# EAGLE design water-pump (EAGLE 9.2.2)
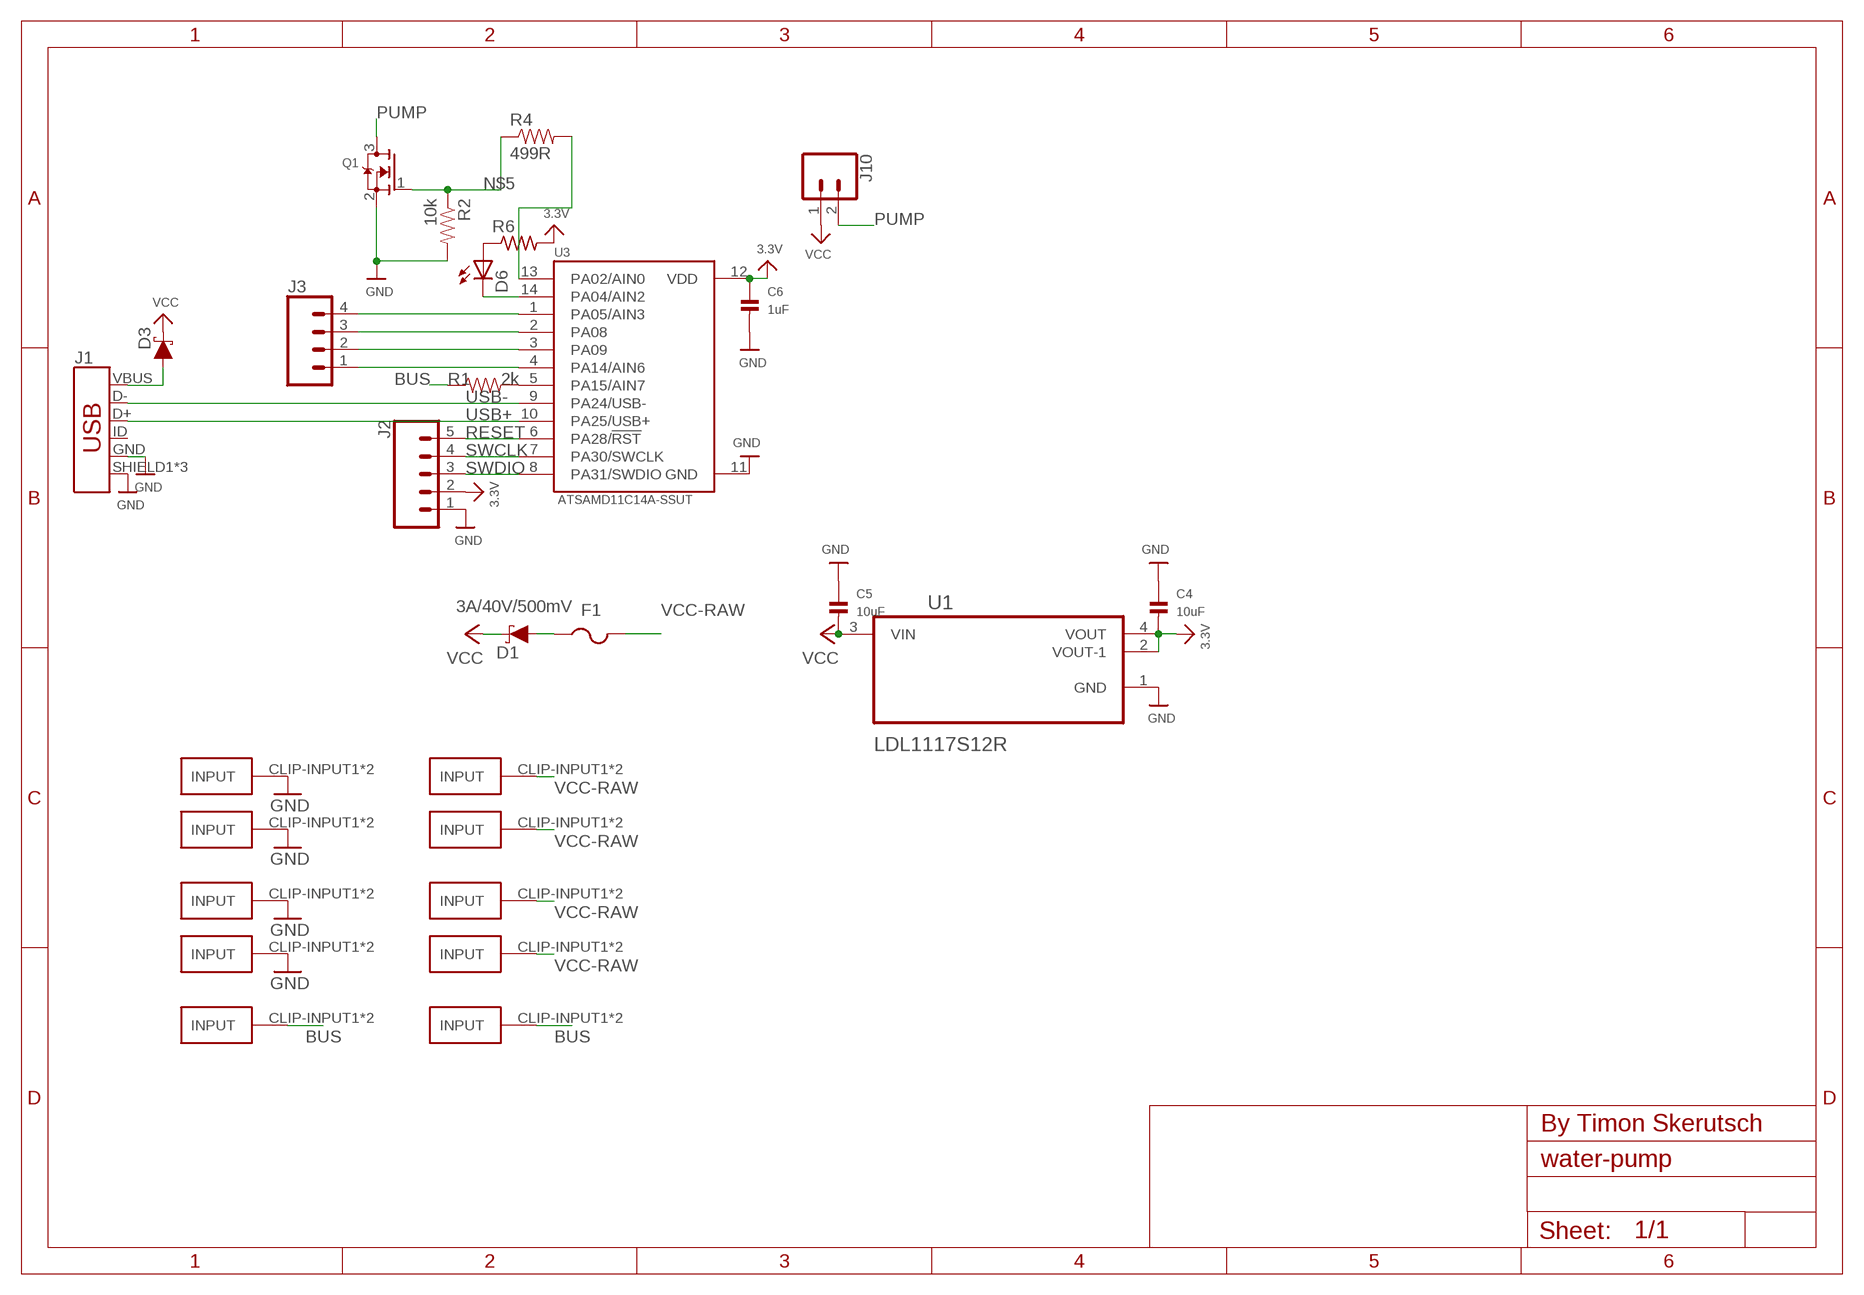
[diagram p0: schematic, sheet 1]

## Parts
C4  10uF  CAP_CERAMIC0805  [0805]
C5  10uF  CAP_CERAMIC0805  [0805]
C6  1uF  CAP_CERAMIC0603  [0603]
D1  3A/40V/500mV  DIODE-SCHOTTKY-B340A  [SMA-DIODE]
D3  3A/40V/500mV  DIODE-SCHOTTKY-B340A  [SMA-DIODE]
D6  LEDCHIPLED_0805  [CHIPLED_0805]
F1  PTCFUSE-1812  [1812]
GND-CLIP  FUSE-HOLDER-5X20MM  [FUSE-HOLDER-5X20MM]
GND-CLIP1  FUSE-HOLDER-5X20MM  [FUSE-HOLDER-5X20MM]
GND-CLIP2  FUSE-HOLDER-5X20MM  [FUSE-HOLDER-5X20MM]
GND-CLIP3  FUSE-HOLDER-5X20MM  [FUSE-HOLDER-5X20MM]
J1  USB_MICRO-B_FEMALE-SMT  [USB-B-MICRO-SMD]
J2  CONN_05  [1X05]
J3  CONN_04PTH  [1X04]
J10  CONN_02PTH3  [1X02_LONGPADS]
PWM-CLIP  FUSE-HOLDER-5X20MM  [FUSE-HOLDER-5X20MM]
PWM-CLIP1  FUSE-HOLDER-5X20MM  [FUSE-HOLDER-5X20MM]
Q1  MOSFET-NWIDE  [SOT23-WIDE]
R1  2k  RESISTOR1206  [1206]
R2  10k  RESISTOR1206  [1206]
R4  499R  RESISTOR1206  [1206]
R6  R-US_R0805  [R0805]
U1  LDL1117S12R  [SOT230P700X180-4N]
U3  ATSAMD11C14A-SSUT  [SOIC127P600X160-14N]
VCC-CLIP  FUSE-HOLDER-5X20MM  [FUSE-HOLDER-5X20MM]
VCC-CLIP1  FUSE-HOLDER-5X20MM  [FUSE-HOLDER-5X20MM]
VCC-CLIP2  FUSE-HOLDER-5X20MM  [FUSE-HOLDER-5X20MM]
VCC-CLIP3  FUSE-HOLDER-5X20MM  [FUSE-HOLDER-5X20MM]

## Nets
3.3V [VCC]: C4.2 C6.1 J2.2 R6.2 U1.2(VOUT-1) U1.4(VOUT) U3.12(VDD)
BUS: PWM-CLIP1.CLIP-INPUT1(INPUT) PWM-CLIP1.CLIP-INPUT2(INPUT) PWM-CLIP.CLIP-INPUT1(INPUT) PWM-CLIP.CLIP-INPUT2(INPUT) R1.1
GND: C4.1 C5.1 C6.2 GND-CLIP1.CLIP-INPUT1(INPUT) GND-CLIP1.CLIP-INPUT2(INPUT) GND-CLIP2.CLIP-INPUT1(INPUT) GND-CLIP2.CLIP-INPUT2(INPUT) GND-CLIP3.CLIP-INPUT1(INPUT) GND-CLIP3.CLIP-INPUT2(INPUT) GND-CLIP.CLIP-INPUT1(INPUT) GND-CLIP.CLIP-INPUT2(INPUT) J1.GND J1.SHIELD1(SHIELD) J1.SHIELD2(SHIELD) J1.SHIELD3(SHIELD) J2.1 Q1.2(S) R2.2 U1.1(GND) U3.11(GND)
N$1: D3.A J1.VBUS
N$3: R1.2 U3.5(PA15/AIN7)
N$4: J3.4 U3.1(PA05/AIN3)
N$5: Q1.1(G) R2.1 R4.1
N$6 [VCC]: D1.A F1.1
N$7: D6.A R6.1
N$8: D6.C U3.14(PA04/AIN2)
N$9: J3.3 U3.2(PA08)
N$10: J3.2 U3.3(PA09)
N$11: J3.1 U3.4(PA14/AIN6)
PUMP: J10.2 Q1.3(D)
PUMP_CTRL: R4.2 U3.13(PA02/AIN0)
RESET: J2.5 U3.6(PA28/!RST)
SWCLK: J2.4 U3.7(PA30/SWCLK)
SWDIO: J2.3 U3.8(PA31/SWDIO)
USB+: J1.D+ U3.10(PA25/USB+)
USB-: J1.D- U3.9(PA24/USB-)
VCC [VCC]: C5.2 D1.C D3.C J10.1 U1.3(VIN)
VCC-RAW [VCC]: F1.2 VCC-CLIP1.CLIP-INPUT1(INPUT) VCC-CLIP1.CLIP-INPUT2(INPUT) VCC-CLIP2.CLIP-INPUT1(INPUT) VCC-CLIP2.CLIP-INPUT2(INPUT) VCC-CLIP3.CLIP-INPUT1(INPUT) VCC-CLIP3.CLIP-INPUT2(INPUT) VCC-CLIP.CLIP-INPUT1(INPUT) VCC-CLIP.CLIP-INPUT2(INPUT)
Unconnected: J1.ID

## Notes on the sheet
- By Timon Skerutsch

## Library data of the parts
C4-C6 = microbuilder:CAP_CERAMIC: Ceramic Capacitors 0402 - 0402 Surface Mount Capacitors 16pF 50V 5% [Digikey: 445-4899-2-ND] 18pF 50V 5% [Digikey: 490-1281-2-ND] 22pF 50V 5% [Digikey: 490-1283-2-ND] 68pF 50V 5% [Digikey: 490-1289-2-ND] 0.1uF 10V 10% [Digikey: 490-1318-2-ND] 1.0uF 6.3V 10% [Digikey: 490-1320-2-ND] 0603 - 0603 Surface Mount Capacitors 16 pF 50V 5% [Digikey: 445-5051-2-ND] 22 pF 50V [Digikey: PCC220ACVTR-ND] 33 pF 50V 5% [Digikey: 490-1415-1-ND] 56pF 50V 5% [Digikey: 490-1421-1-ND] 220pF 50V 5% [Digikey: 445-1285-1-ND] 680 pF 50V 2200 pF 50V 5% C0G [Digikey: 445-1297-1-ND] 5600 pF 100V 5% X7R [Digikey: 478-3711-1-ND] 0.1 µF 25V 10% [Digikey: PCC2277TR-ND] 0.22 µF 16V 10% X7R [Digikey: 445-1318-1-ND] 1.0 µF 25V 10% [Digikey: 445-5146-2-ND] 0603 - RF Specific 3pF 250V +/-0.1pF RF [Digikey: 712-1347-1-ND] 18 pF 250V 5% [Digikey: 478-3505-1-ND or 712-1322-1-ND] 56 pF 250V 5% C0G RF [Digikey: 490-4867-1-ND] 68 pF 250V RF [Digikey: 490-4868-1-ND] 0805 - 0805 Surface Mount Capacitors 220 pF 250V 2% RF Ceramic Capacitor [Digikey: 712-1398-1-ND] 1000 pF 50V 2% NP0 Ceramic Capacitor [Digikey: 478-3760-1-ND] 0.1 µF 25V 10% Ceramic Capacitor [Digikey: PCC1828TR-ND] 1.0 µF 16V 10% Ceramic Capacitor[Digikey: 490-1691-2-ND] 10.0 µF 10V 10% Ceramic Capacitor[Digikey: 709-1228-1-ND] 10.0 uF 16V 10% Ceramic Capacitor [Digikey: 478-5165-2-ND] 47 uF 6.3V 20% Ceramic Capacitor [Digikey: 587-1779-1-ND or 399-5506-1-ND] 1206 - 1206 Surface Mount Capacitors 47uF 10V 20% Ceramic Capacitor [Digikey: 490-5528-1-ND or 399-5508-1-ND or 445-6010-1-ND] 100uF 6.3V -20%, +80% Y5V Ceramic Capacitor (Digikey: 490-4512-1-ND, Mouser: 81-GRM31CF50J107ZE1L)
D1 D3 = SparkFun-DiscreteSemi:DIODE-SCHOTTKY: Schottky diode A Schottky diode is a semiconductor diode which has a low forward voltage drop and a very fast switching action.; PROD_ID: DIO-09886
D6 = Adafruit:LED: LED OSRAM: - CHIPLED LG R971, LG N971, LY N971, LG Q971, LY Q971, LO R971, LY R971 LH N974, LH R974 LS Q976, LO Q976, LY Q976 LO Q996 - Hyper CHIPLED LW Q18S LB Q993, LB Q99A, LB R99A - SideLED LS A670, LO A670, LY A670, LG A670, LP A670 LB A673, LV A673, LT A673, LW A673 LH A674 LY A675 LS A676, LA A676, LO A676, LY A676, LW A676 LS A679, LY A679, LG A679 - Hyper Micro SIDELED® LS Y876, LA Y876, LO Y876, LY Y876 LT Y87S - SmartLED LW L88C, LW L88S LB L89C, LB L89S, LG L890 LS L89K, LO L89K, LY L89K LS L896, LA L896, LO L896, LY L896 - TOPLED LS T670, LO T670, LY T670, LG T670, LP T670 LSG T670, LSP T670, LSY T670, LOP T670, LYG T670 LG T671, LOG T671, LSG T671 LB T673, LV T673, LT T673, LW T673 LH T674 LS T676, LA T676, LO T676, LY T676, LB T676, LH T676, LSB T676, LW T676 LB T67C, LV T67C, LT T67C, LS T67K, LO T67K, LY T67K, LW E67C LS E67B, LA E67B, LO E67B, LY E67B, LB E67C, LV E67C, LT E67C LW T67C LS T679, LY T679, LG T679 LS T770, LO T770, LY T770, LG T770, LP T770 LB T773, LV T773, LT T773, LW T773 LH T774 LS E675, LA E675, LY E675, LS T675 LS T776, LA T776, LO T776, LY T776, LB T776 LHGB T686 LT T68C, LB T68C - Hyper Mini TOPLED® LB M676 - Mini TOPLED Santana® LG M470 LS M47K, LO M47K, LY M47K Source: http://www.osram.convergy.de/
F1 = Adafruit:PTCFUSE: PTC fuses, resettable thermistors
GND-CLIP GND-CLIP1-GND-CLIP3 PWM-CLIP PWM-CLIP1 VCC-CLIP VCC-CLIP1-VCC-CLIP3 = timon-diverses:FUSE-HOLDER-5X20MM
J1 = SparkFun-Connectors:USB_MICRO-B: USB Type Micro-B Connector Male/female and PTH/SMT variants SparkFun Products: SparkFun microB USB Breakout <https://www.sparkfun.com/products/12035> SparkFun USB microB Plug Breakout <https://www.sparkfun.com/products/10031> SparkFun ESP8266 Thing <https://www.sparkfun.com/products/13231>; PROD_ID: CONN-11752
J2 = SparkFun-Connectors:CONN_05: Multi connection point. Often used as Generic Header-pin footprint for 0.1 inch spaced/style header connections On any of the 0.1 inch spaced packages, you can populate with these: Break Away Headers - Straight <https://www.sparkfun.com/products/116> (PRT-00116) Break Away Male Headers - Right Angle <https://www.sparkfun.com/products/553> (PRT-00553) Female Headers <https://www.sparkfun.com/products/115> (PRT-00115) Break Away Headers - Machine Pin <https://www.sparkfun.com/products/117> (PRT-00117) Break Away Female Headers - Swiss Machine Pin <https://www.sparkfun.com/products/743> (PRT-00743) For SCREWTERMINALS and SPRING TERMINALS visit here: Screw Terimnals on SparkFun.com <https://www.sparkfun.com/search/results?term=Screw+Terminals> (5mm/3.5mm/2.54mm spacing) This device is also useful as a general connection point to wire up your design to another part of your project. Our various solder wires solder well into these plated through hole pads. Hook-Up Wire - Assortment (Stranded, 22 AWG) <https://www.sparkfun.com/products/11375> (PRT-11375) Hook-Up Wire - Assortment (Solid Core, 22 AWG) <https://www.sparkfun.com/products/11367> (PRT-11367) View the entire wire category on our website here <https://www.sparkfun.com/categories/141> Special notes: Molex polarized connector foot print use with SKU : PRT-08231 with associated crimp pins and housings. 1MM SMD Version SKU: PRT-10208
J3 = SparkFun-Connectors:CONN_04: Multi connection point. Often used as Generic Header-pin footprint for 0.1 inch spaced/style header connections On any of the 0.1 inch spaced packages, you can populate with these: Break Away Headers - Straight <https://www.sparkfun.com/products/116> (PRT-00116) Break Away Male Headers - Right Angle <https://www.sparkfun.com/products/553> (PRT-00553) Female Headers <https://www.sparkfun.com/products/115> (PRT-00115) Break Away Headers - Machine Pin <https://www.sparkfun.com/products/117> (PRT-00117) Break Away Female Headers - Swiss Machine Pin <https://www.sparkfun.com/products/743> (PRT-00743) For SCREWTERMINALS and SPRING TERMINALS visit here: Screw Terimnals on SparkFun.com <https://www.sparkfun.com/search/results?term=Screw+Terminals> (5mm/3.5mm/2.54mm spacing) This device is also useful as a general connection point to wire up your design to another part of your project. Our various solder wires solder well into these plated through hole pads. Hook-Up Wire - Assortment (Stranded, 22 AWG) <https://www.sparkfun.com/products/11375> (PRT-11375) Hook-Up Wire - Assortment (Solid Core, 22 AWG) <https://www.sparkfun.com/products/11367> (PRT-11367) View the entire wire category on our website here <https://www.sparkfun.com/categories/141> Special notes: Molex polarized connector foot print use with SKU : PRT-08231 with associated crimp pins and housings. 1MM SMD Version SKU: PRT-10208; PROD_ID: CONN-09696
J10 = SparkFun-Connectors:CONN_02: Multi connection point. Often used as Generic Header-pin footprint for 0.1 inch spaced/style header connections On any of the 0.1 inch spaced packages, you can populate with these: Break Away Headers - Straight <https://www.sparkfun.com/products/116> (PRT-00116) Break Away Male Headers - Right Angle <https://www.sparkfun.com/products/553> (PRT-00553) Female Headers <https://www.sparkfun.com/products/115> (PRT-00115) Break Away Headers - Machine Pin <https://www.sparkfun.com/products/117> (PRT-00117) Break Away Female Headers - Swiss Machine Pin <https://www.sparkfun.com/products/743> (PRT-00743) For SCREWTERMINALS and SPRING TERMINALS visit here: Screw Terimnals on SparkFun.com <https://www.sparkfun.com/search/results?term=Screw+Terminals> (5mm/3.5mm/2.54mm spacing) This device is also useful as a general connection point to wire up your design to another part of your project. Our various solder wires solder well into these plated through hole pads. Hook-Up Wire - Assortment (Stranded, 22 AWG) <https://www.sparkfun.com/products/11375> (PRT-11375) Hook-Up Wire - Assortment (Solid Core, 22 AWG) <https://www.sparkfun.com/products/11367> (PRT-11367) View the entire wire category on our website here <https://www.sparkfun.com/categories/141> Special notes: Molex polarized connector foot print use with: PRT-08233 with associated crimp pins and housings. 2.54_SCREWTERM for use with PRT-10571. 3.5mm Screw Terminal footprints for PRT-08084 5mm Screw Terminal footprints for use with PRT-08432
Q1 = microbuilder:MOSFET-N: N-Channel Mosfet LEGEND VDS: Voltage Drain-Source ID: Drain Current RDS(ON): Drain-Source On-State Resistance VGS(TH): Gate-Source Threshold Voltage CISS: Drain-Source Input Capacitance SOT-23 Name VDS ID RDS(ON) VGS(TH) CISS Order Number 2N7002E 60V 260mA 2.5 Ohm 2.5V @ 250uA 26.7pF @ 25V 2N7002ET1GOSTR-ND BSH103 30V 850mA 400 mOhm 400mV @ 1mA 83pF @ 24V BSH103,235-ND BSS138 60V 320mA 1.6 Ohm 1.5V @ 250uA 50pF @ 10V Mouser: 771-BSS138PW115 DMN2075U-7 20V 4.2A 38 mOhm 1V @ 250 uA 594.3pF @ 10V DMN2075U-7DICT-ND * BSS138 good choice for I2C level-shifting
R1 R2 R4 = SparkFun-Resistors:RESISTOR: Resistor Basic schematic elements and footprints for 0603, 1206, and PTH resistors.
R6 = Adafruit:R-US_: RESISTOR, American symbol
U1 = LDL1117S12R:LDL1117S12R: None; AVAILABILITY: Good; DESCRIPTION: 1.2 A High PSRR low dropout linear voltage regulator; MF: STMicroelectronics; MP: LDL1117S12R; PACKAGE: SOT-223 STMicroelectronics; PRICE: 0.22 USD
U3 = ATSAMD11C14A-SSUT:ATSAMD11C14A-SSUT: MCU 32-Bit SAM D11 ARM Cortex M0+ RISC 16KB Flash 1.8V/2.5V/3.3V 14-Pin SOIC T/R; AVAILABILITY: Good; DESCRIPTION: Cortex-M0+, 16KB FLASH, 4KB SRAM, USB - 14 SOIC, INDUSTRIAL, GREEN, 1.6-3.6V, 48MHz/ SOIC .150 (SS); MF: Microchip; MP: ATSAMD11C14A-SSUT; PACKAGE: SOIC-14 Microchip; PRICE: 1.18 USD

## Net classes
1 VCC: clearance 0.508 mm

## Board
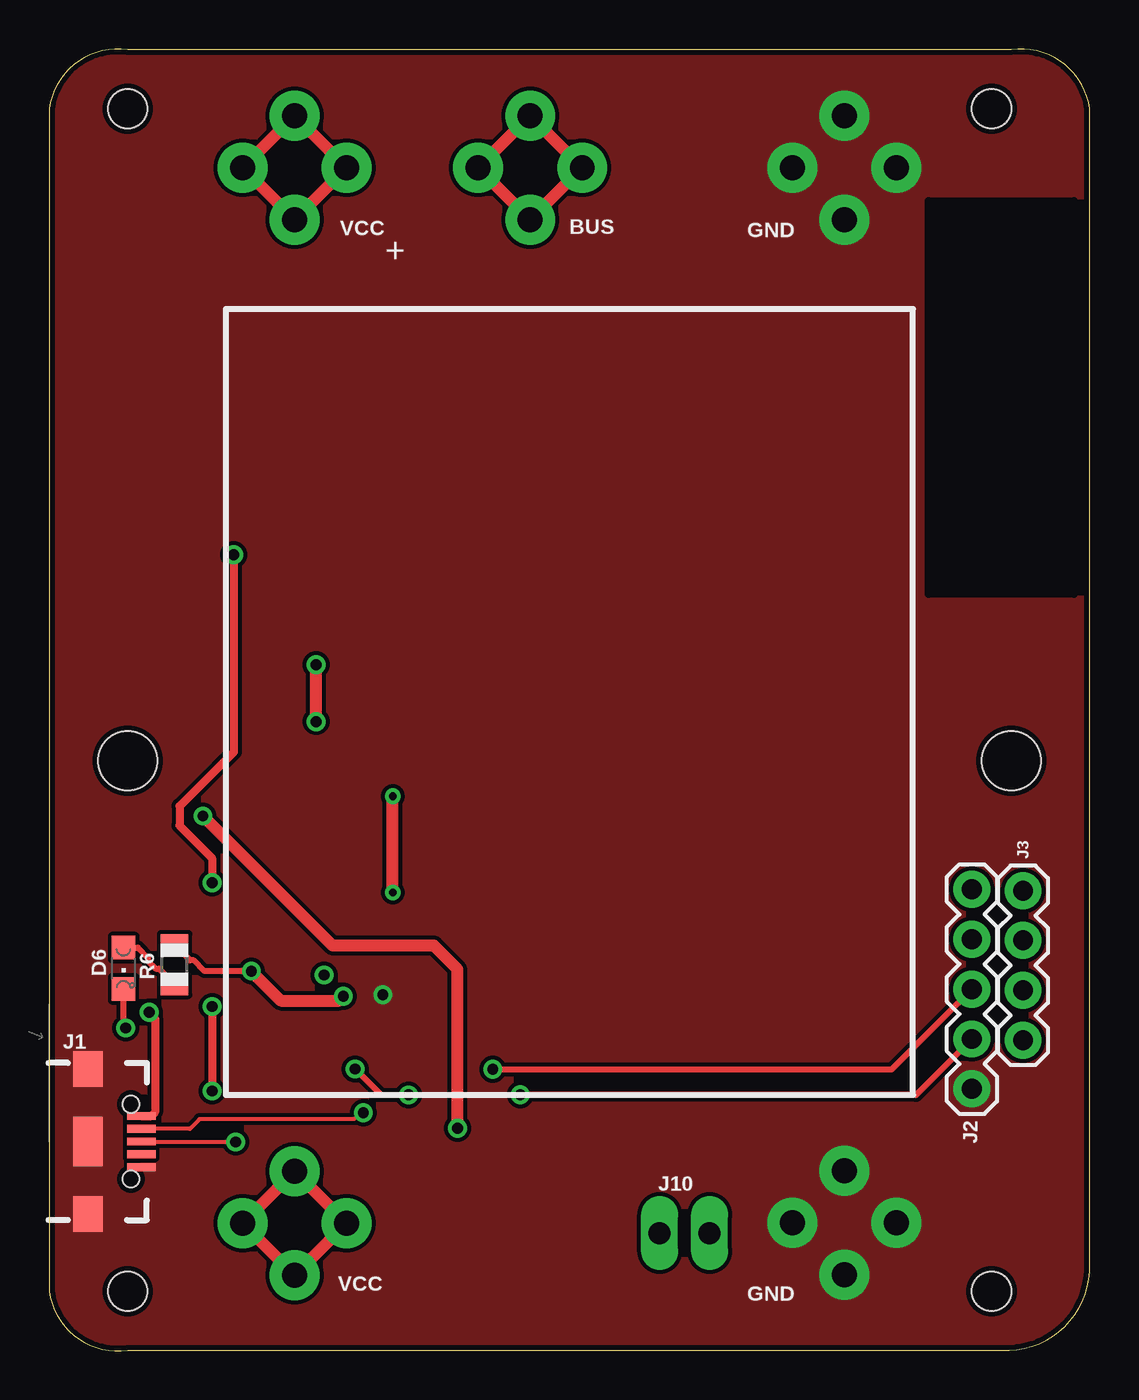
[diagram p1: board, top side]
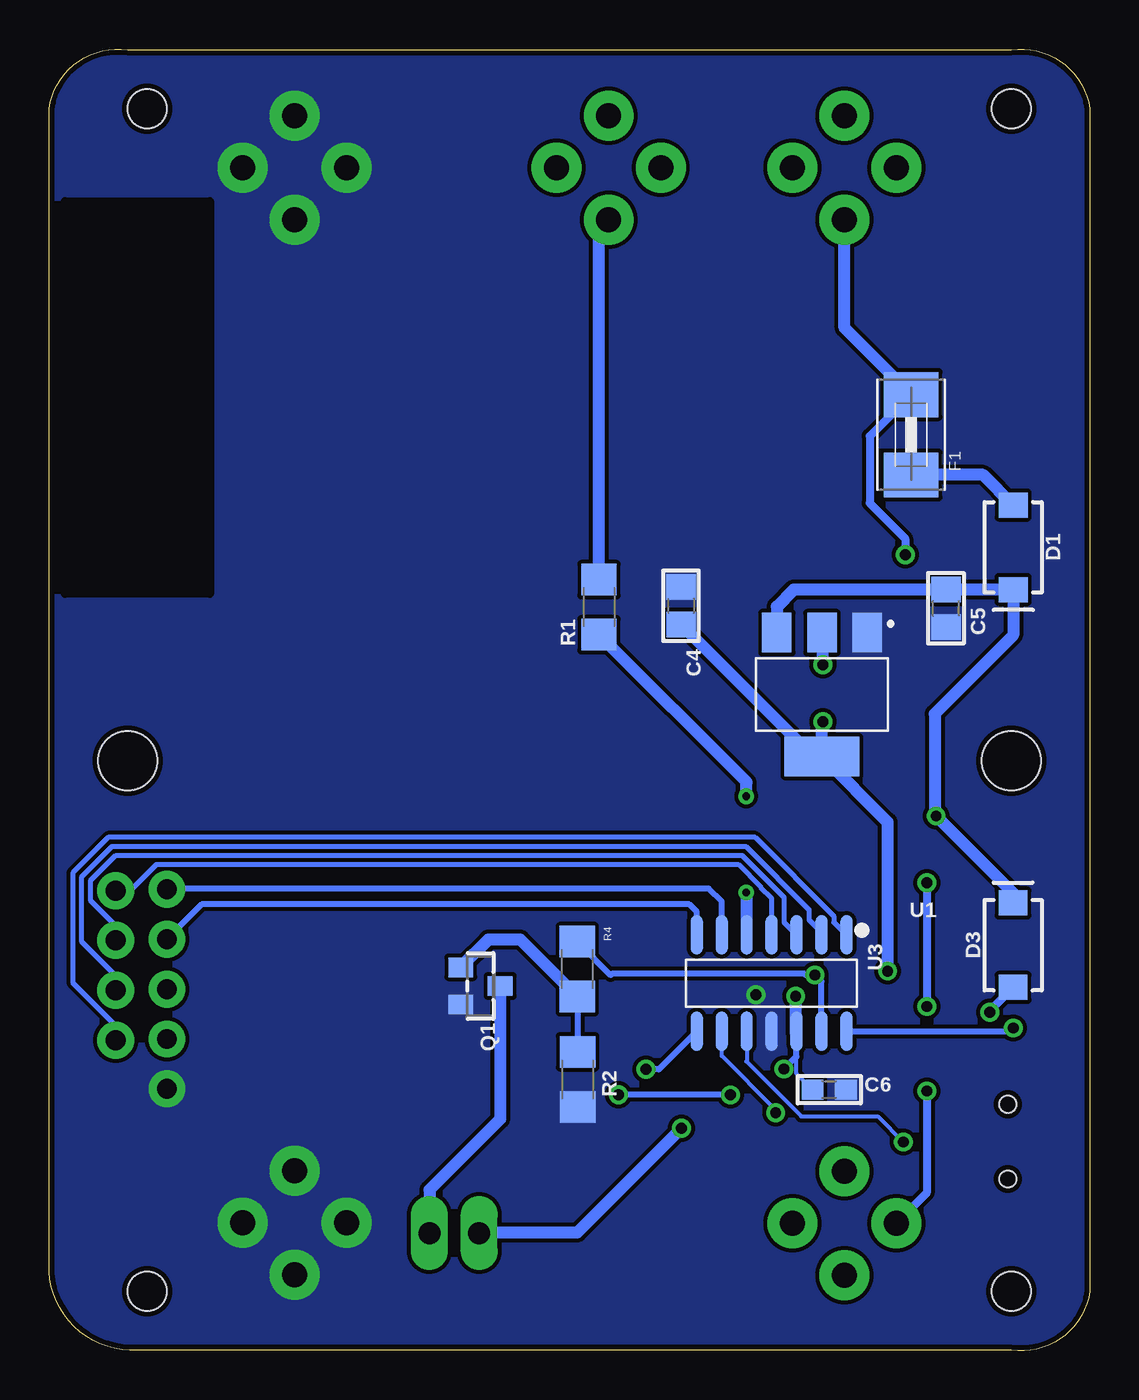
[diagram p2: board, bottom side, seen from below]

Size 53 x 66.26 mm. Coordinates in mm from the lower left corner, seen from the top.
Outline: 48.5,0.03 arc90 53,4.03 53,63.23 arc90 49,66.23 4,66.23 arc90 0,63.23 0,3.03 arc90 4,0.03 48.5,0.03
Copper layers (1*16): Top 0.035mm / dielectric 1.5mm / Bottom 0.035mm
Design rules "default *": minimum track width 8mil, minimum drill 15.5mil, track to track 8mil, track to pad 8mil, pad to pad 8mil, via to via 8mil, smd to smd 0mil, copper to edge 11mil, drill to drill 8mil, minimum pad ring 10mil, minimum via ring 8mil, stop-mask expansion 0.116840625mm, vias tented up to drill 20mil, thermal gap 10mil
Holes 2 mm at 4,63.23 48,63.23 4,3.03 48,3.03
Holes 3 mm at 49,30.03 4,30.03
tRestrict: area 44.8,38.5 to 52.2,58.5
bRestrict: area 44.8,38.5 to 52.2,58.5

### Footprints (pad centres in the part's own frame; a part is rotated, then mirrored left to right if it is on the bottom)
0805 = smd 1.3 x 1.5: 1 -0.95,0; 2 0.95,0
0603 = smd 1.1 x 1: 1 -0.85,0; 2 0.85,0
SMA-DIODE = smd 1.27 x 1.47: A -2.15,0; C 2.15,0
CHIPLED_0805 = smd 1.2 x 1.2: A 0,-1.05; C 0,1.05
1812 = smd 2.286 x 2.794: 1 -2.046,0; 2 2.046,0
FUSE-HOLDER-5X20MM = drill 1.27 pad 2.54: CLIP-INPUT1 -2.65,0; CLIP-INPUT2 2.65,0
USB-B-MICRO-SMD = smd 1.45 x 0.4: D+ 2.725,0; D- 2.725,0.65; GND 2.725,-1.3; ID 2.725,-0.65; VBUS 2.725,1.3 | smd 1.5 x 1.8: SHIELD1 0,3.685; SHIELD2 0,-3.685 | smd 1.5 x 2.5: SHIELD3 0,0 | hole 0.85: 2.2,1.9; 2.2,-1.9
1X05 = drill 1.016 pad 1.88: 1 0,0; 2 2.54,0; 3 5.08,0; 4 7.62,0; 5 10.16,0
1X04 = drill 1.016 pad 1.88: 1 0,0; 2 2.54,0; 3 5.08,0; 4 7.62,0
1X02_LONGPADS = drill 1.118 pad 1.88 long: 1 0,0; 2 2.54,0
SOT23-WIDE = smd 1 x 1.27: 1 -0.95,-1; 2 0.95,-1; 3 0,1
1206 = smd 1.6 x 1.8: 1 -1.4,0; 2 1.4,0
R0805 = smd 1.1 x 1.4: 1 -1,0; 2 1,0
SOT230P700X180-4N = smd 1.5 x 2: 1 -2.3,-3.15; 2 0,-3.15; 3 2.3,-3.15 | smd 3.8 x 2: 4 0,3.15
SOIC127P600X160-14N = smd 2 x 0.6: 1 -2.45,3.81; 2 -2.45,2.54; 3 -2.45,1.27; 4 -2.45,0; 5 -2.45,-1.27; 6 -2.45,-2.54; 7 -2.45,-3.81; 8 2.45,-3.81; 9 2.45,-2.54; 10 2.45,-1.27; 11 2.45,0; 12 2.45,1.27; 13 2.45,2.54; 14 2.45,3.81

### Placement (x,y rotation side)
C4  20.82,37.93 270 bottom
C5  7.33,37.8 90 bottom
C6  13.27,13.3 0 bottom
D1  3.9,40.9 270 bottom
D3  3.91,20.66 90 bottom
D6  3.79,19.47 180 top
F1  9.1,46.63 90 bottom
GND-CLIP  40.5,60.23 0 bottom
GND-CLIP1  40.5,6.53 90 bottom
GND-CLIP2  40.5,6.53 0 bottom
GND-CLIP3  40.5,60.23 90 bottom
J1  1.97,10.66 0 top
J2  47,13.34 90 top
J3  49.6,23.43 270 top
J10  31.09,5.99 0 top
PWM-CLIP  24.5,60.23 0 bottom
PWM-CLIP1  24.5,60.23 90 bottom
Q1  31.03,18.57 270 bottom
R1  24.99,37.86 270 bottom
R2  26.08,13.82 270 bottom
R4  26.1,19.43 90 bottom
R6  6.39,19.66 90 top
U1  13.64,33.41 180 bottom
U3  16.2,18.72 270 bottom
VCC-CLIP  12.5,60.23 0 bottom
VCC-CLIP1  12.5,6.49 90 bottom
VCC-CLIP2  12.5,6.49 0 bottom
VCC-CLIP3  12.5,60.23 270 bottom

### Tracks (layer width: path | path; a pad name or v marks a point on that pad's centre or on a via)
3.3V  (via drill 0.55)
  Top 0.305: R6.2 7.18,19.87 7.37,19.87 7.91,19.33 v10.3,19.33 | J2.2 44.16,13.03 v24,13.03 | v15.58,14.35 16.9,13.03 v18.3,13.03
  Top 0.61: v13.6,32.03 v13.6,34.93 | v10.3,19.33 11.8,17.83 14.77,17.83 v14.98,18.05
  Bottom 0.203: C6.1 14.94,14.11 14.94,16.03 14.94,16.13 U3.12
  Bottom 0.305: v15.58,14.35 14.94,15 14.94,16.03 | v18.3,13.03 v24,13.03
  Bottom 0.61: U1.4 13.64,31.99 v13.6,32.03 | v13.6,34.93 13.6,36.52 U1.2 | U1.4 14.1,30.26 C4.2 | U1.4 10.3,26.92 v10.3,19.33 | v14.98,18.05 14.98,16.18 14.94,16.13
BUS
  Top 0.61: PWM-CLIP1.CLIP-INPUT1 PWM-CLIP.CLIP-INPUT2 PWM-CLIP1.CLIP-INPUT2 PWM-CLIP.CLIP-INPUT1 PWM-CLIP1.CLIP-INPUT1 | PWM-CLIP1.CLIP-INPUT1
  Bottom 0.61: R1.1 24.99,57.09 PWM-CLIP1.CLIP-INPUT1
GND  (via drill 0.55)
  other vias: 17,18.13
  pour Top (rank 2, no thermals): -0.5,67.33 53.5,67.33 53.5,-0.77 -0.5,-0.77
  pour Bottom (rank 2, no thermals): 53.4,67.33 -0.6,67.33 -0.6,-0.77 53.4,-0.77
N$1  (via drill 0.55)
  Top 0.406: J1.VBUS 5.2,11.96 5.4,12.16 5.4,16.93 v5.1,17.23
  Bottom 0.406: v5.1,17.23 5.1,17.31 D3.A
N$3  (via drill 0.39)
  Top 0.61: v17.5,23.33 v17.5,28.23
  Bottom 0.61: R1.2 17.48,28.94 17.5,28.94 v17.5,28.23 | U3.5 17.48,23.33 v17.5,23.33
N$4
  Bottom 0.203: 12.42,21.2 U3.1
  Bottom 0.254: J3.4 49.6,16.56 51.78,18.74 51.78,24.34 49.98,26.14 17.04,26.14 13.04,22.13 13.04,21.81 12.42,21.2
N$5
  Bottom 0.305: R4.1 26.1,15.23 R2.1
  Bottom 0.61: R4.1 29,20.93 30.62,20.93 Q1.1
N$6
  Bottom 0.61: D1.A 5.44,44.59 F1.1
N$7
  Top 0.305: D6.A 4.53,20.52 5.03,20.02 5.03,19.84 5.42,19.45 5.6,19.45 R6.1
N$8  (via drill 0.55)
  Top 0.305: v3.9,16.43 3.79,16.54 D6.C
  Bottom 0.305: U3.14 4.06,16.27 v3.9,16.43
N$9
  Bottom 0.203: 13.6,21.24 13.6,21.23 | 13.6,21.23 U3.2 | 13.7,21.33 13.6,21.23
  Bottom 0.254: J3.3 49.6,19.1 51.33,20.82 51.33,24.15 49.8,25.68 17.52,25.68 14.3,22.46 14.3,21.94 13.7,21.33
N$10
  Bottom 0.254: J3.2 49.6,21.64 50.87,22.91 50.87,23.96 49.61,25.22 17.71,25.22 15.57,23.09 15.57,21.81 U3.3
N$11
  Bottom 0.254: J3.1 48.86,23.43 47.53,24.77 17.9,24.77 16.77,23.63 16.77,23.6 16.2,23.03 U3.4
PUMP
  Bottom 0.61: Q1.3 30.03,11.79 33.63,8.19 J10.2
PUMP_CTRL  (via drill 0.55)
  Bottom 0.305: U3.13 13.66,18.8 v14,19.13 14.46,19.13 14.51,19.19 24.35,19.19 24.4,19.13 R4.2
RESET
  Bottom 0.305: U3.6 18.75,22.88 19.4,23.53 46.96,23.53 J2.5
SWCLK
  Bottom 0.305: U3.7 20.02,22.35 20.4,22.73 45.22,22.73 J2.4
SWDIO  (via drill 0.55)
  Top 0.305: v22.6,14.33 42.92,14.33 J2.3
  Bottom 0.305: U3.8 21.95,14.33 v22.6,14.33
USB+  (via drill 0.55)
  Top 0.203: J1.D+ 4.72,10.63 v9.5,10.63
  Bottom 0.203: U3.10 17.48,14.76 17.5,14.73 14.7,11.93 10.8,11.93 v9.5,10.63
USB-  (via drill 0.55)
  Top 0.203: v16,12.13 15.86,12.13 15.53,11.8 7.67,11.8 7.17,11.31 J1.D-
  Bottom 0.203: U3.9 18.75,15.01 16,12.27 v16,12.13
VCC  (via drill 0.55)
  Top 0.61: v7.83,27.23 14.44,20.62 19.6,20.62 20.8,19.42 v20.8,11.33
  Bottom 0.61: U1.3 15.94,37.89 15.08,38.75 C5.2 D1.C 3.9,36.43 7.9,32.43 7.9,27.23 v7.83,27.23 3.91,23.31 D3.C | J10.1 30.99,5.99 30.96,6.03 26.1,6.03 v20.8,11.33
VCC-RAW  (via drill 0.55)
  Top 0.406: v9.4,40.53 9.4,30.48 6.64,27.73 6.64,26.74 8.3,25.08 v8.3,23.83 | v8.3,17.53 v8.3,13.23
  Top 0.61: VCC-CLIP3.CLIP-INPUT1 VCC-CLIP.CLIP-INPUT2 VCC-CLIP3.CLIP-INPUT2 VCC-CLIP.CLIP-INPUT1 VCC-CLIP3.CLIP-INPUT1 | VCC-CLIP1.CLIP-INPUT2 VCC-CLIP2.CLIP-INPUT2 VCC-CLIP1.CLIP-INPUT1 VCC-CLIP2.CLIP-INPUT1 VCC-CLIP1.CLIP-INPUT2
  Bottom 0.406: v9.4,40.53 9.4,41.34 11.21,43.15 11.21,46.57 F1.2 | v8.3,23.83 v8.3,17.53 | v8.3,13.23 8.3,8.04 VCC-CLIP2.CLIP-INPUT2
  Bottom 0.61: F1.2 12.5,52.08 VCC-CLIP3.CLIP-INPUT2

### Text on the board
tPlace: +
tNames: VCC | BUS | GND | VCC | GND
Measures: PUMP